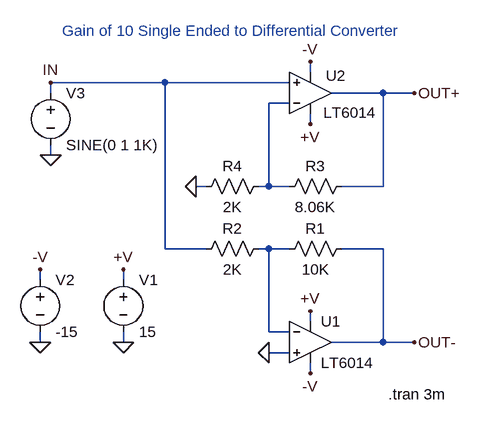
[diagram p0: schematic 6014.asc]
6014.asc, the LTspice schematic file:
Version 4
SHEET 1 896 680
WIRE 192 -160 192 -176
WIRE -32 -144 -208 -144
WIRE 160 -144 -32 -144
WIRE -208 -128 -208 -144
WIRE 304 -128 224 -128
WIRE 352 -128 304 -128
WIRE 160 -112 128 -112
WIRE 192 -80 192 -96
WIRE -208 -32 -208 -48
WIRE 32 16 16 16
WIRE 128 16 128 -112
WIRE 128 16 112 16
WIRE 160 16 128 16
WIRE 304 16 304 -128
WIRE 304 16 240 16
WIRE -32 112 -32 -144
WIRE 32 112 -32 112
WIRE 128 112 112 112
WIRE 160 112 128 112
WIRE 304 112 240 112
WIRE -224 160 -224 144
WIRE -96 160 -96 144
WIRE 192 224 192 208
WIRE 128 240 128 112
WIRE 160 240 128 240
WIRE -224 256 -224 240
WIRE -96 256 -96 240
WIRE 304 256 304 112
WIRE 304 256 224 256
WIRE 352 256 304 256
WIRE 160 272 128 272
WIRE 192 304 192 288
FLAG -96 256 0
FLAG 192 208 +V
FLAG -96 144 +V
FLAG 192 304 -V
FLAG -224 256 0
FLAG -224 144 -V
FLAG -208 -32 0
FLAG 192 -80 +V
FLAG 192 -176 -V
FLAG 16 16 0
FLAG 128 272 0
FLAG 352 -128 OUT+
FLAG 352 256 OUT-
FLAG -208 -144 IN
SYMBOL voltage -96 144 R0
SYMATTR InstName V1
SYMATTR Value 15
SYMBOL voltage -224 144 R0
SYMATTR InstName V2
SYMATTR Value -15
SYMBOL res 256 96 R90
WINDOW 0 0 56 VBottom 0
WINDOW 3 32 56 VTop 0
SYMATTR InstName R1
SYMATTR Value 10K
SYMBOL res 128 96 R90
WINDOW 0 0 56 VBottom 0
WINDOW 3 32 56 VTop 0
SYMATTR InstName R2
SYMATTR Value 2K
SYMBOL voltage -208 -144 R0
SYMATTR InstName V3
SYMATTR Value SINE(0 1 1K)
SYMBOL res 256 0 R90
WINDOW 0 0 56 VBottom 0
WINDOW 3 32 56 VTop 0
SYMATTR InstName R3
SYMATTR Value 8.06K
SYMBOL res 128 0 R90
WINDOW 0 0 56 VBottom 0
WINDOW 3 32 56 VTop 0
SYMATTR InstName R4
SYMATTR Value 2K
SYMBOL opamps\\LT6014 192 256 R0
SYMATTR InstName U1
SYMBOL opamps\\LT6014 192 -128 M180
WINDOW 0 24 27 Left 0
WINDOW 3 20 -30 Left 0
SYMATTR InstName U2
TEXT 312 336 Left 0 !.tran 3m
TEXT 72 -208 Bottom 0 ;Gain of 10 Single Ended to Differential Converter

The netlist it stands for:
* 6014.asc
V1 +V 0 15
V2 -V 0 -15
R1 OUT- N002 10K
R2 N002 IN 2K
V3 IN 0 SINE(0 1 1K)
R3 OUT+ N001 8.06K
R4 N001 0 2K
* U1: LT6014 (symbol opamps\LT6014 not available, pins judged from their places): In+=0 In-=N002 V+=+V V-=-V OUT=OUT-
* U2: LT6014 (symbol opamps\LT6014 not available, pins judged from their places): In+=IN In-=N001 V+=+V V-=-V OUT=OUT+
.tran 3m
* Gain of 10 Single Ended to Differential Converter
.backanno
.end